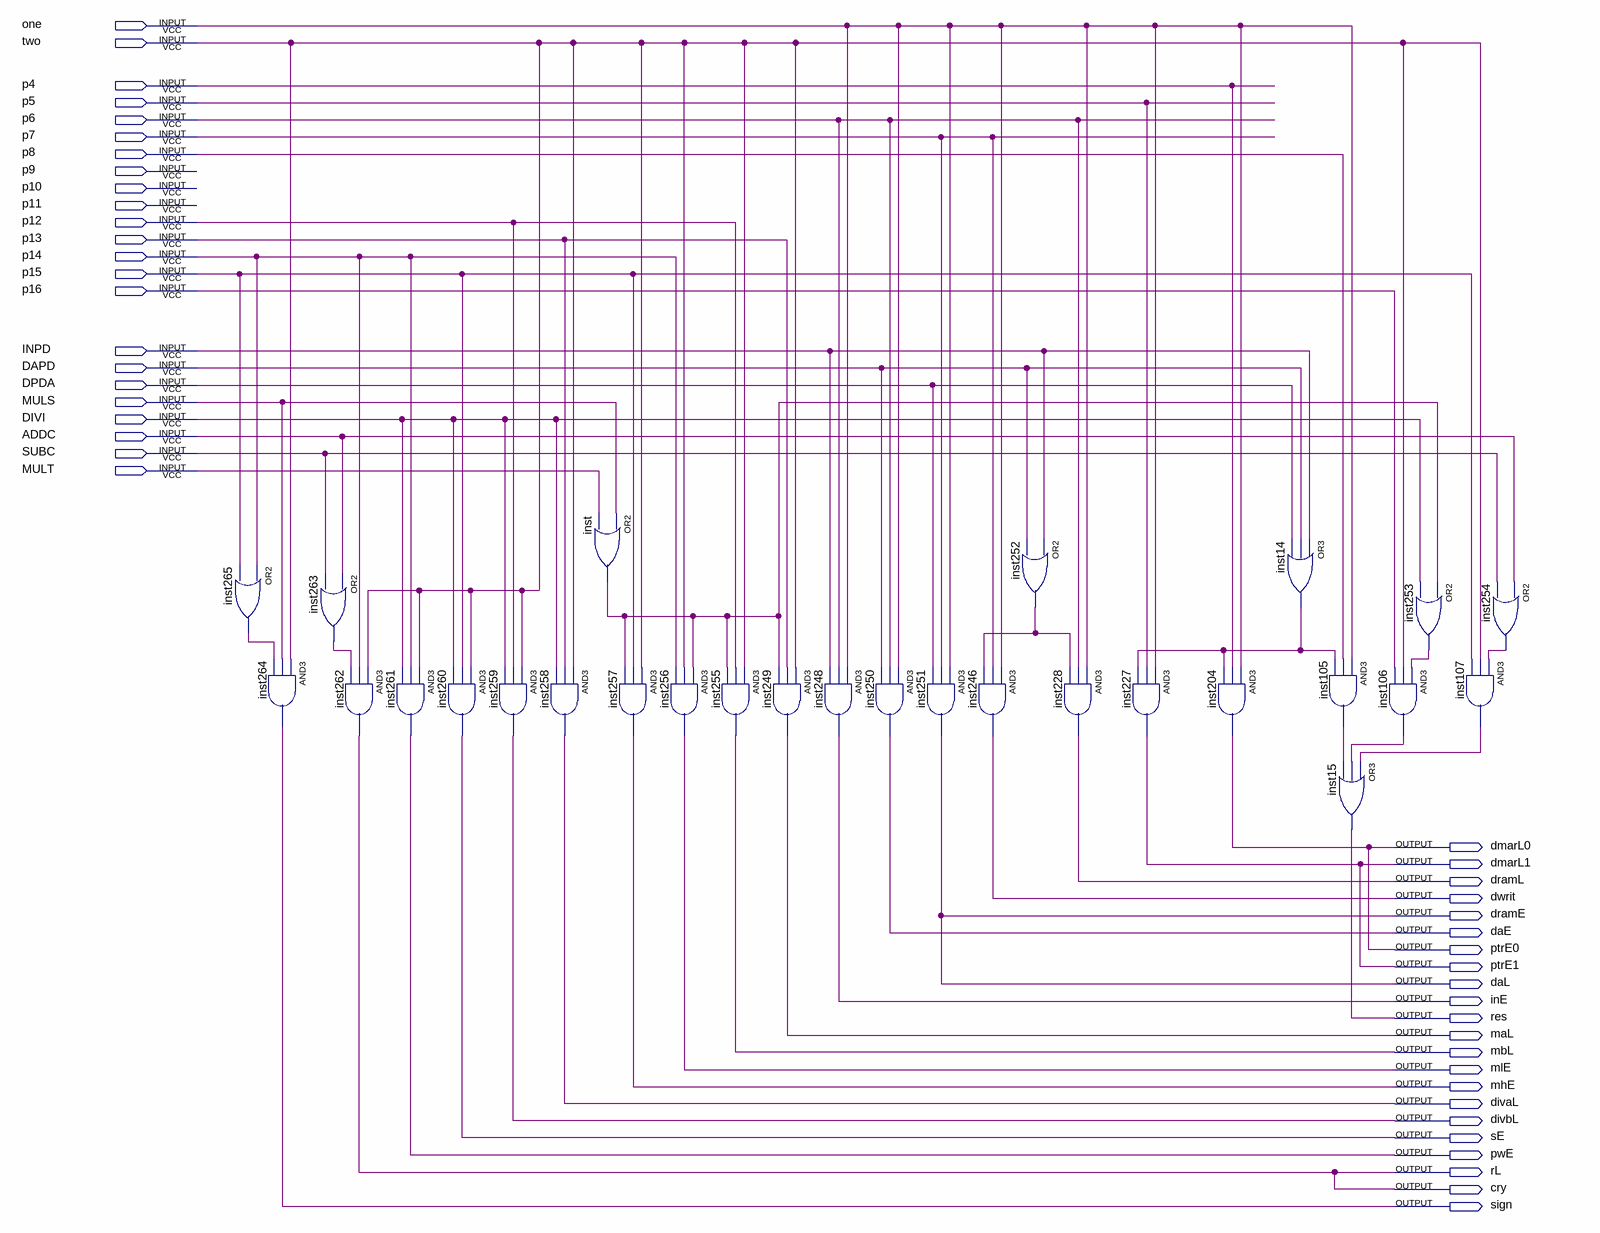
[diagram p0: schematic sheet]
// Quartus schematic kzjz_b.bdf as structural Verilog: 28 symbols, 45 pins
module kzjz_b (
  input  one,
  input  two,
  input  p4,
  input  p5,
  input  p6,
  input  p7,
  input  p8,
  input  p9,
  input  p10,
  input  p11,
  input  p12,
  input  p13,
  input  p14,
  input  p15,
  input  p16,
  input  INPD,
  input  DAPD,
  input  DPDA,
  input  MULS,
  input  DIVI,
  input  ADDC,
  input  SUBC,
  input  MULT,
  output dmarL0,
  output dmarL1,
  output dramL,
  output dwrit,
  output dramE,
  output daE,
  output ptrE0,
  output ptrE1,
  output daL,
  output inE,
  output res,
  output maL,
  output mbL,
  output mlE,
  output mhE,
  output divaL,
  output divbL,
  output sE,
  output pwE,
  output rL,
  output cry,
  output sign
);

  wire inst14_out, inst105_out, inst106_out, inst107_out, inst252_out, inst253_out, inst254_out, inst263_out,
       inst265_out, inst_out;

  or inst265 (inst265_out, p14, p15);
  and inst264 (sign, two, MULS, inst265_out);
  or inst263 (inst263_out, ADDC, SUBC);
  and inst261 (pwE, two, p14, DIVI);
  and inst262 (cry, two, p14, inst263_out);
  and inst260 (sE, two, p15, DIVI);
  and inst259 (divbL, two, p12, DIVI);
  or inst (inst_out, MULS, MULT);
  and inst258 (divaL, two, p13, DIVI);
  and inst256 (mlE, inst_out, two, p14);
  and inst257 (mhE, two, p15, inst_out);
  and inst255 (mbL, two, p12, inst_out);
  and inst249 (maL, two, p13, inst_out);
  and inst250 (daE, one, p6, DAPD);
  and inst248 (inE, one, p6, INPD);
  and inst251 (daL, one, p7, DPDA);
  or inst252 (inst252_out, INPD, DAPD);
  and inst246 (dwrit, one, p7, inst252_out);
  and inst228 (dramL, one, p6, inst252_out);
  and inst227 (dmarL1, one, p5, inst14_out);
  and inst204 (dmarL0, one, p4, inst14_out);
  or inst14 (inst14_out, INPD, DAPD, DPDA);
  and inst105 (inst105_out, one, p8, inst14_out);
  or inst15 (res, inst107_out, inst106_out, inst105_out);
  or inst253 (inst253_out, inst_out, DIVI);
  and inst106 (inst106_out, inst253_out, two, p16);
  or inst254 (inst254_out, ADDC, SUBC);
  and inst107 (inst107_out, inst254_out, two, p15);

  assign dramE = daL;
  assign ptrE0 = dmarL0;
  assign ptrE1 = dmarL1;
  assign rL = cry;
endmodule
